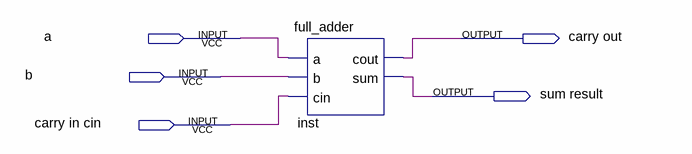
[diagram p0: schematic sheet]
// Quartus schematic full_adder_block.bdf as structural Verilog: 1 symbols, 5 pins
module full_adder_block (
  input  a,
  input  b,
  input  \carry_in_cin ,
  output \carry_out ,
  output \sum_result 
);

  full_adder inst (.a(a), .b(b), .cin(\carry_in_cin ), .cout(\carry_out ), .sum(\sum_result ));
endmodule
